# Altium schematic sheet z80.SchDoc
size A; SheetNumber: 1; SheetTotal: 3
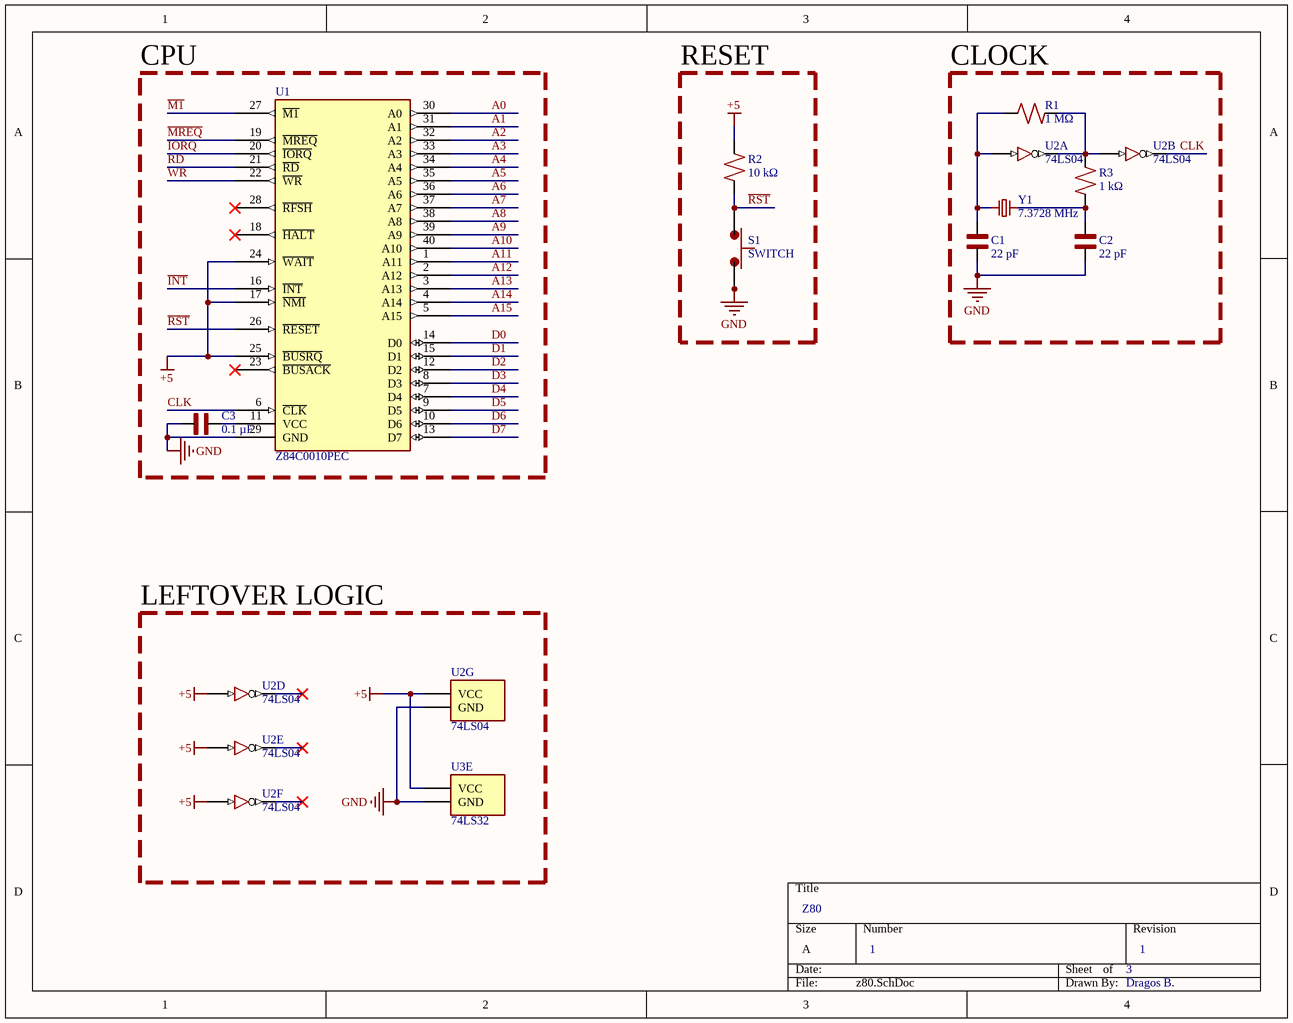
[diagram p0: z80.SchDoc]

## Parts
C1  22 pF  [Capacitor]
C2  22 pF  [Capacitor]
C3  0.1 µF  [Capacitor]
R1  1 MΩ  [Axial 0.4]
R2  10 kΩ  [Axial 0.4]
R3  1 kΩ  [Axial 0.4]
S1  SWITCH  [SW_PTS645SL43SMTR92LFS]
U1  Z84C0010PEC  [DIP40]
U2  74LS04  [DIP14]  (parts A,B,D,E,F,G of 7)
U3  74LS32  [DIP14]  (part E of 5)
Y1  7.3728 MHz  [HC49S]

## Blocks framed on the sheet
CPU: C3 U1
RESET: R2 S1
CLOCK: C1 C2 R1 R3 U2 Y1
LEFTOVER LOGIC: U2 U3

## Nets
+5: R2.2 U1.17(~{NMI}) U1.24(~{WAIT}) U1.25(~{BUSRQ}) U2.9(A4) U2.11(A5) U2.13(A6) U2.14(VCC) U3.14(VCC)
GND: C1.1 C2.1 C3.2 S1.3 S1.4 U1.29(GND) U2.7(GND) U3.7(GND)
~{INT}: U1.16(~{INT})
~{IORQ}: U1.20(~{IORQ})
~{M1}: U1.27(~{M1})
~{MREQ}: U1.19(~{MREQ})
~{RD}: U1.21(~{RD})
~{RST}: R2.1 S1.1 S1.2 U1.26(~{RESET})
~{WR}: U1.22(~{WR})
A0: U1.30(A0)
A1: U1.31(A1)
A2: U1.32(A2)
A3: U1.33(A3)
A4: U1.34(A4)
A5: U1.35(A5)
A6: U1.36(A6)
A7: U1.37(A7)
A8: U1.38(A8)
A9: U1.39(A9)
A10: U1.40(A10)
A11: U1.1(A11)
A12: U1.2(A12)
A13: U1.3(A13)
A14: U1.4(A14)
A15: U1.5(A15)
CLK: U1.6(~{CLK}) U2.4(Y2)
D0: U1.14(D0)
D1: U1.15(D1)
D2: U1.12(D2)
D3: U1.8(D3)
D4: U1.7(D4)
D5: U1.9(D5)
D6: U1.10(D6)
D7: U1.13(D7)
NetC1_2: C1.2 R1.2 U2.1(A1) Y1.1
NetC2_2: C2.2 R3.1 Y1.2
NetC3_1: C3.1 U1.11(VCC)
NetR1_1: R1.1 R3.2 U2.2(A2) U2.3(A2)

Not connected (* = marked no-connect by the designer): U1 18(~{HALT})* 23(~{BUSACK})* 28(~{RFSH})*; U2 8(Y4)* 10(Y5)* 12(Y6)*

## Notes on the sheet
- Z80
- 1
- 3
- Dragos B.

## Library data of the parts
C1-C3 = CAPACITOR: MP: ECWFG70105K; MF: Panasonic; SnapEDA_Link: https://www.snapeda.com/parts/ECWFG70105K/Panasonic/view-part/?ref=snap; Availability: In Stock; Price: None; Check_prices: https://www.snapeda.com/parts/ECWFG70105K/Panasonic/view-part/?ref=eda; Value: *; Purchase-URL: https://pricing.snapeda.com/search/part/ECWFG70105K/?ref=eda; Package: MOLDED-2 Panasonic
R1-R3 = RESISTOR: MP: ERJU01J131C; Package: None; Availability: Unavailable; Value: *; Price: None
S1 = SWITCH: MF: ALPS; MP: SKRPABE010; SnapEDA_Link: https://www.snapeda.com/parts/SKRPABE010/ALPS/view-part/?ref=snap; Package: None; Value: *; Check_prices: https://www.snapeda.com/parts/SKRPABE010/ALPS/view-part/?ref=eda
U2 = 74LS04: Hex Inverters
Y1 = CRYSTAL: MF: IQD Frequency Products; MP: LFXTAL003056B; SnapEDA_Link: https://www.snapeda.com/parts/LFXTAL003056B/IQD+Frequency+Products/view-part/?ref=snap; Package: None; Value: *; Check_prices: https://www.snapeda.com/parts/LFXTAL003056B/IQD+Frequency+Products/view-part/?ref=eda